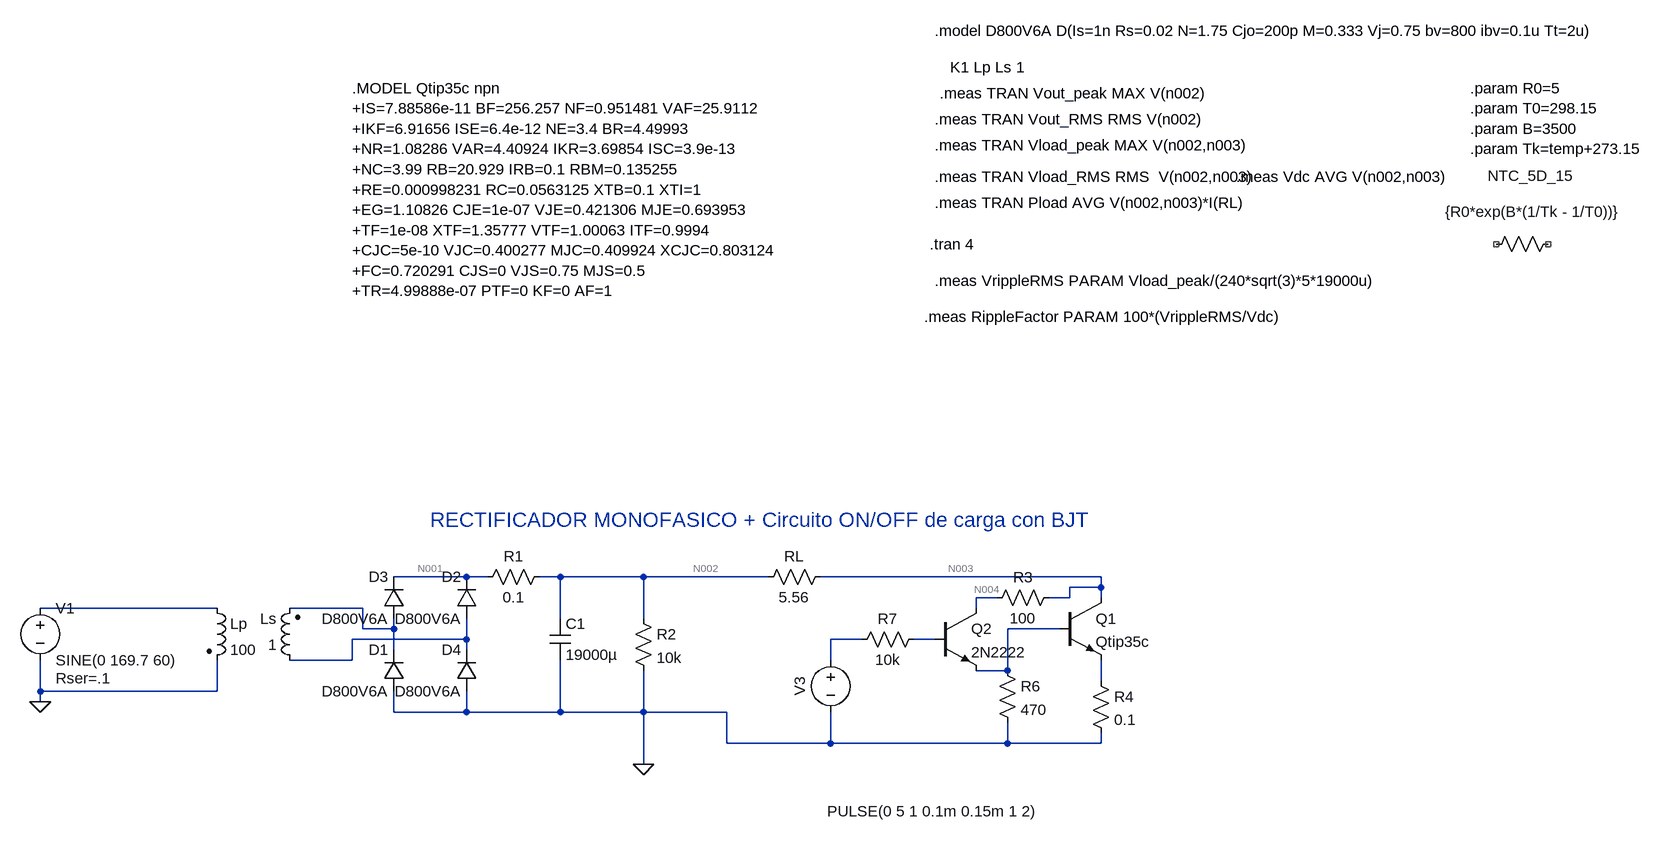
[diagram p0: schematic BJT Simulation.asc]
BJT Simulation.asc, the LTspice schematic file:
Version 4.1
SHEET 1 2096 824
WIRE 0 80 -112 80
WIRE 32 80 0 80
WIRE 144 80 112 80
WIRE 272 80 144 80
WIRE 464 80 272 80
WIRE 976 80 544 80
WIRE 976 96 976 80
WIRE 976 96 928 96
WIRE 816 112 784 112
WIRE 928 112 928 96
WIRE 928 112 896 112
WIRE 976 112 976 96
WIRE -384 128 -656 128
WIRE -160 128 -272 128
WIRE 784 128 784 112
WIRE 144 144 144 80
WIRE 272 144 272 80
WIRE -160 160 -160 128
WIRE -112 160 -112 144
WIRE -112 160 -160 160
WIRE 912 160 832 160
WIRE 0 176 0 144
WIRE 0 176 -176 176
WIRE 608 176 560 176
WIRE 720 176 688 176
WIRE -112 192 -112 160
WIRE 0 192 0 176
WIRE -176 208 -176 176
WIRE -176 208 -272 208
WIRE 560 208 560 176
WIRE 832 224 832 160
WIRE 832 224 784 224
WIRE 976 240 976 208
WIRE -656 256 -656 208
WIRE -384 256 -384 208
WIRE -384 256 -656 256
WIRE -656 272 -656 256
WIRE -112 288 -112 256
WIRE 0 288 0 256
WIRE 0 288 -112 288
WIRE 144 288 144 208
WIRE 144 288 0 288
WIRE 272 288 272 224
WIRE 272 288 144 288
WIRE 400 288 272 288
WIRE 400 336 400 288
WIRE 560 336 560 288
WIRE 560 336 400 336
WIRE 832 336 832 304
WIRE 832 336 560 336
WIRE 976 336 976 320
WIRE 976 336 832 336
WIRE 272 368 272 288
FLAG -656 272 0
FLAG 272 368 0
SYMBOL diode -96 256 R180
WINDOW 0 24 64 Left 2
WINDOW 3 24 0 Left 2
SYMATTR InstName D1
SYMATTR Value D800V6A
SYMBOL diode 16 144 R180
WINDOW 0 24 64 Left 2
WINDOW 3 24 0 Left 2
SYMATTR InstName D2
SYMATTR Value D800V6A
SYMBOL diode -96 144 R180
WINDOW 0 24 64 Left 2
WINDOW 3 24 0 Left 2
SYMATTR InstName D3
SYMATTR Value D800V6A
SYMBOL diode 16 256 R180
WINDOW 0 24 64 Left 2
WINDOW 3 24 0 Left 2
SYMATTR InstName D4
SYMATTR Value D800V6A
SYMBOL voltage -656 112 R0
WINDOW 123 0 0 Left 0
WINDOW 39 24 124 Left 2
SYMATTR SpiceLine Rser=.1
SYMATTR InstName V1
SYMATTR Value SINE(0 169.7 60)
SYMBOL ind2 -400 112 R0
SYMATTR InstName Lp
SYMATTR Value 100
SYMBOL ind2 -256 224 R180
WINDOW 0 36 80 Left 2
WINDOW 3 36 40 Left 2
SYMATTR InstName Ls
SYMATTR Value 1
SYMBOL res 1680 -448 R90
WINDOW 0 -74 42 VBottom 2
WINDOW 3 -18 39 VBottom 2
SYMATTR InstName NTC_5D_15
SYMATTR Value {R0*exp(B*(1/Tk - 1/T0))}
SYMBOL res 256 128 R0
SYMATTR InstName R2
SYMATTR Value 10k
SYMBOL voltage 560 192 R0
WINDOW 0 -32 56 VBottom 2
WINDOW 3 157 233 Top 2
WINDOW 123 0 0 Left 0
WINDOW 39 0 0 Left 0
SYMATTR InstName V3
SYMATTR Value PULSE(0 5 1 0.1m 0.15m 1 2)
SYMBOL npn 912 112 R0
SYMATTR InstName Q1
SYMATTR Value Qtip35c
SYMBOL res 960 224 R0
SYMATTR InstName R4
SYMATTR Value 0.1
SYMBOL res 448 96 R270
WINDOW 0 32 56 VTop 2
WINDOW 3 0 56 VBottom 2
SYMATTR InstName RL
SYMATTR Value 5.56
SYMBOL npn 720 128 R0
SYMATTR InstName Q2
SYMATTR Value 2N2222
SYMBOL res 704 160 R90
WINDOW 0 0 56 VBottom 2
WINDOW 3 32 56 VTop 2
SYMATTR InstName R7
SYMATTR Value 10k
SYMBOL res 912 96 R90
WINDOW 0 0 56 VBottom 2
WINDOW 3 32 56 VTop 2
SYMATTR InstName R3
SYMATTR Value 100
SYMBOL res 816 208 R0
SYMATTR InstName R6
SYMATTR Value 470
SYMBOL res 128 64 R90
WINDOW 0 0 56 VBottom 2
WINDOW 3 32 56 VTop 2
SYMATTR InstName R1
SYMATTR Value 0.1
SYMBOL cap 128 144 R0
WINDOW 3 24 56 Left 2
SYMATTR InstName C1
SYMATTR Value 19000µ
SYMATTR Description Capacitor
SYMATTR Type cap
SYMATTR SpiceLine V=25 Irms=555m Rser=0.13 Lser=0 mfg="Chemi-Con" pn="LXF25VB221M8X15LL" type="Al electrolytic"
TEXT 712 -432 Left 2 !.tran 4
TEXT -56 -8 Left 3 ;RECTIFICADOR MONOFASICO + Circuito ON/OFF de carga con BJT
TEXT 720 -760 Left 2 !.model D800V6A D(Is=1n Rs=0.02 N=1.75 Cjo=200p M=0.333 Vj=0.75 bv=800 ibv=0.1u Tt=2u)
TEXT 744 -704 Left 2 !K1 Lp Ls 1
TEXT 728 -664 Left 2 !.meas TRAN Vout_peak MAX V(n002)
TEXT 720 -624 Left 2 !.meas TRAN Vout_RMS RMS V(n002)
TEXT 720 -584 Left 2 !.meas TRAN Vload_peak MAX V(n002,n003)
TEXT 720 -536 Left 2 !.meas TRAN Vload_RMS RMS  V(n002,n003)
TEXT 720 -496 Left 2 !.meas TRAN Pload AVG V(n002,n003)*I(RL)
TEXT 1184 -536 Left 2 !.meas Vdc AVG V(n002,n003)
TEXT 720 -376 Left 2 !.meas VrippleRMS PARAM Vload_peak/(240*sqrt(3)*5*19000u)
TEXT 704 -320 Left 2 !.meas RippleFactor PARAM 100*(VrippleRMS/Vdc)
TEXT 1544 -672 Left 2 !.param R0=5\n.param T0=298.15\n.param B=3500\n.param Tk=temp+273.15
TEXT -176 -672 Left 2 !.MODEL Qtip35c npn\n+IS=7.88586e-11 BF=256.257 NF=0.951481 VAF=25.9112\n+IKF=6.91656 ISE=6.4e-12 NE=3.4 BR=4.49993\n+NR=1.08286 VAR=4.40924 IKR=3.69854 ISC=3.9e-13\n+NC=3.99 RB=20.929 IRB=0.1 RBM=0.135255\n+RE=0.000998231 RC=0.0563125 XTB=0.1 XTI=1\n+EG=1.10826 CJE=1e-07 VJE=0.421306 MJE=0.693953\n+TF=1e-08 XTF=1.35777 VTF=1.00063 ITF=0.9994\n+CJC=5e-10 VJC=0.400277 MJC=0.409924 XCJC=0.803124\n+FC=0.720291 CJS=0 VJS=0.75 MJS=0.5\n+TR=4.99888e-07 PTF=0 KF=0 AF=1

The netlist it stands for:
* BJT Simulation.asc
D1 0 N006 D800V6A
D2 N008 N001 D800V6A
D3 N006 N001 D800V6A
D4 0 N008 D800V6A
V1 N005 0 SINE(0 169.7 60) Rser=.1
Lp N005 0 100
Ls N008 N006 1
R§NTC_5D_15 NC_01 NC_02 {R0*exp(B*(1/Tk - 1/T0))}
R2 N002 0 10k
V3 N009 0 PULSE(0 5 1 0.1m 0.15m 1 2)
Q1 N003 N007 N011 0 Qtip35c
R4 N011 0 0.1
RL N002 N003 5.56
Q2 N004 N010 N007 0 2N2222
R7 N010 N009 10k
R3 N003 N004 100
R6 N007 0 470
R1 N002 N001 0.1
C1 N002 0 19000µ V=25 Irms=555m Rser=0.13 Lser=0 mfg="Chemi-Con" pn="LXF25VB221M8X15LL" type="Al electrolytic"
.model D D
.lib standard.dio
.model NPN NPN
.model PNP PNP
.lib standard.bjt
.tran 4
* RECTIFICADOR MONOFASICO + Circuito ON/OFF de carga con BJT
.model D800V6A D(Is=1n Rs=0.02 N=1.75 Cjo=200p M=0.333 Vj=0.75 bv=800 ibv=0.1u Tt=2u)
K1 Lp Ls 1
.meas TRAN Vout_peak MAX V(n002)
.meas TRAN Vout_RMS RMS V(n002)
.meas TRAN Vload_peak MAX V(n002,n003)
.meas TRAN Vload_RMS RMS  V(n002,n003)
.meas TRAN Pload AVG V(n002,n003)*I(RL)
.meas Vdc AVG V(n002,n003)
.meas VrippleRMS PARAM Vload_peak/(240*sqrt(3)*5*19000u)
.meas RippleFactor PARAM 100*(VrippleRMS/Vdc)
.param R0=5
.param T0=298.15
.param B=3500
.param Tk=temp+273.15
.MODEL Qtip35c npn
+IS=7.88586e-11 BF=256.257 NF=0.951481 VAF=25.9112
+IKF=6.91656 ISE=6.4e-12 NE=3.4 BR=4.49993
+NR=1.08286 VAR=4.40924 IKR=3.69854 ISC=3.9e-13
+NC=3.99 RB=20.929 IRB=0.1 RBM=0.135255
+RE=0.000998231 RC=0.0563125 XTB=0.1 XTI=1
+EG=1.10826 CJE=1e-07 VJE=0.421306 MJE=0.693953
+TF=1e-08 XTF=1.35777 VTF=1.00063 ITF=0.9994
+CJC=5e-10 VJC=0.400277 MJC=0.409924 XCJC=0.803124
+FC=0.720291 CJS=0 VJS=0.75 MJS=0.5
+TR=4.99888e-07 PTF=0 KF=0 AF=1
.backanno
.end

* Results of the author's LTspice run, read from the files saved beside the schematic
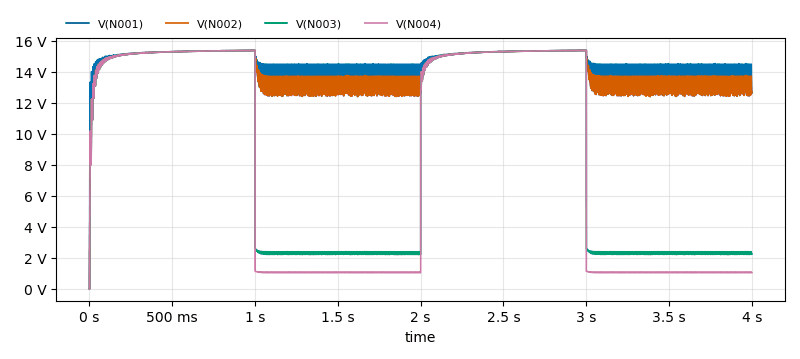
[diagram p1: Transient Analysis of BJT Simulation.asc, plotted from the saved traces]
* Transient Analysis, 1 run:
*   V(N001): min 0 V, max 15.37 V, average 14.12 V, rms 14.17 V, last 12.63 V
*   V(N002): min 0 V, max 15.37 V, average 14.01 V, rms 14.07 V, last 12.63 V
*   V(N003): min 0 V, max 15.37 V, average 8.691 V, rms 10.81 V, last 2.239 V
*   V(N004): min 0 V, max 15.37 V, average 8.078 V, rms 10.72 V, last 1.044 V
* From the log:
*   vout_peak: MAX(V(n002))=15.3667831421 FROM 0 TO 4
*   vout_rms: RMS(V(n002))=14.0700854622 FROM 0 TO 4
*   vload_peak: MAX(V(n002,n003))=12.4773218632 FROM 0 TO 4
*   vload_rms: RMS(V(n002,n003))=7.53321936646 FROM 0 TO 4
*   pload: AVG(V(n002,n003)*I(RL))=10.206725544 FROM 0 TO 4
*   vdc: AVG(V(n002,n003))=5.32384329431 FROM 0 TO 4
*   vripplerms: Vload_peak/(240*sqrt(3)*5*19000u)=0.315955488442
*   ripplefactor: 100*(VrippleRMS/Vdc)=5.93472555398